# EAGLE design CP_Solenoid3 (EAGLE 7.6.0)
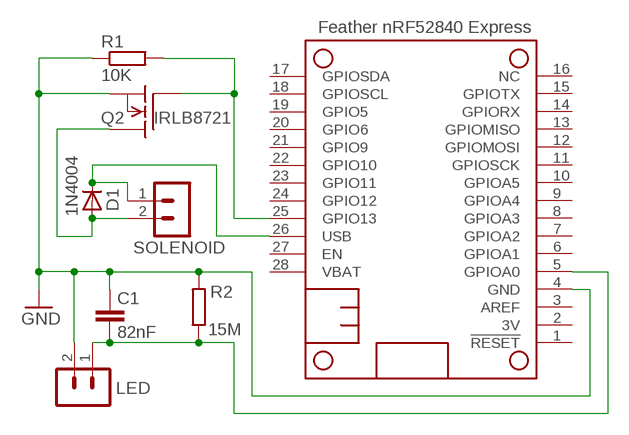
[diagram p0: schematic, sheet 1]

## Parts
C1  82nF  C-EU025-025X050  [C025-025X050]
D1  1N4004  [DO41-10]
LED  B2B-PH-K-S  [B2B-PH-K-S]
MS1  FEATHERWING_NODIM  [FEATHERWING_DIM]
Q2  IRLB8721  IRF510  [TO220]
R1  10K  R-EU_0207/10  [0207/10]
R2  15M  R-EU_0414/15  [0414/15]
SOLENOID  B2B-PH-K-S  [B2B-PH-K-S]

## Nets
GND: C1.1 LED.2 MS1.4(GND) Q2.3(S) R1.1 R2.2
N$2: MS1.25(GPIO13) Q2.1(G) R1.2
N$3: D1.A Q2.2(D) SOLENOID.2
N$7: C1.2 LED.1 MS1.5(GPIOA0) R2.1
USB: D1.C MS1.26(USB) SOLENOID.1
Unconnected: MS1.1(!RESET) MS1.2(3V) MS1.3(AREF) MS1.6(GPIOA1) MS1.7(GPIOA2) MS1.8(GPIOA3) MS1.9(GPIOA4) MS1.10(GPIOA5) MS1.11(GPIOSCK) MS1.12(GPIOMOSI) MS1.13(GPIOMISO) MS1.14(GPIORX) MS1.15(GPIOTX) MS1.16(NC) MS1.17(GPIOSDA) MS1.18(GPIOSCL) MS1.19(GPIO5) MS1.20(GPIO6) MS1.21(GPIO9) MS1.22(GPIO10) MS1.23(GPIO11) MS1.24(GPIO12) MS1.27(EN) MS1.28(VBAT)

## Notes on the sheet
- Feather nRF52840 Express

## Library data of the parts
C1 = rcl:C-EU: CAPACITOR, European symbol
D1 = diode:1N4004: DIODE general purpose rectifier, 1 A
LED SOLENOID = con-JST-ph:B2B-PH: JST PH series header 2.00mm pitch disconnectable crimp style connectors, vertical (side entry type), 2 pins
MS1 = adafruit:FEATHERWING
Q2 = transistor-fet:IRF510: N-Channel Enhancement MOSFET (HEXFET); 100V; 5,6A; 0,54Ohm
R1 R2 = rcl:R-EU_: RESISTOR, European symbol

## Board
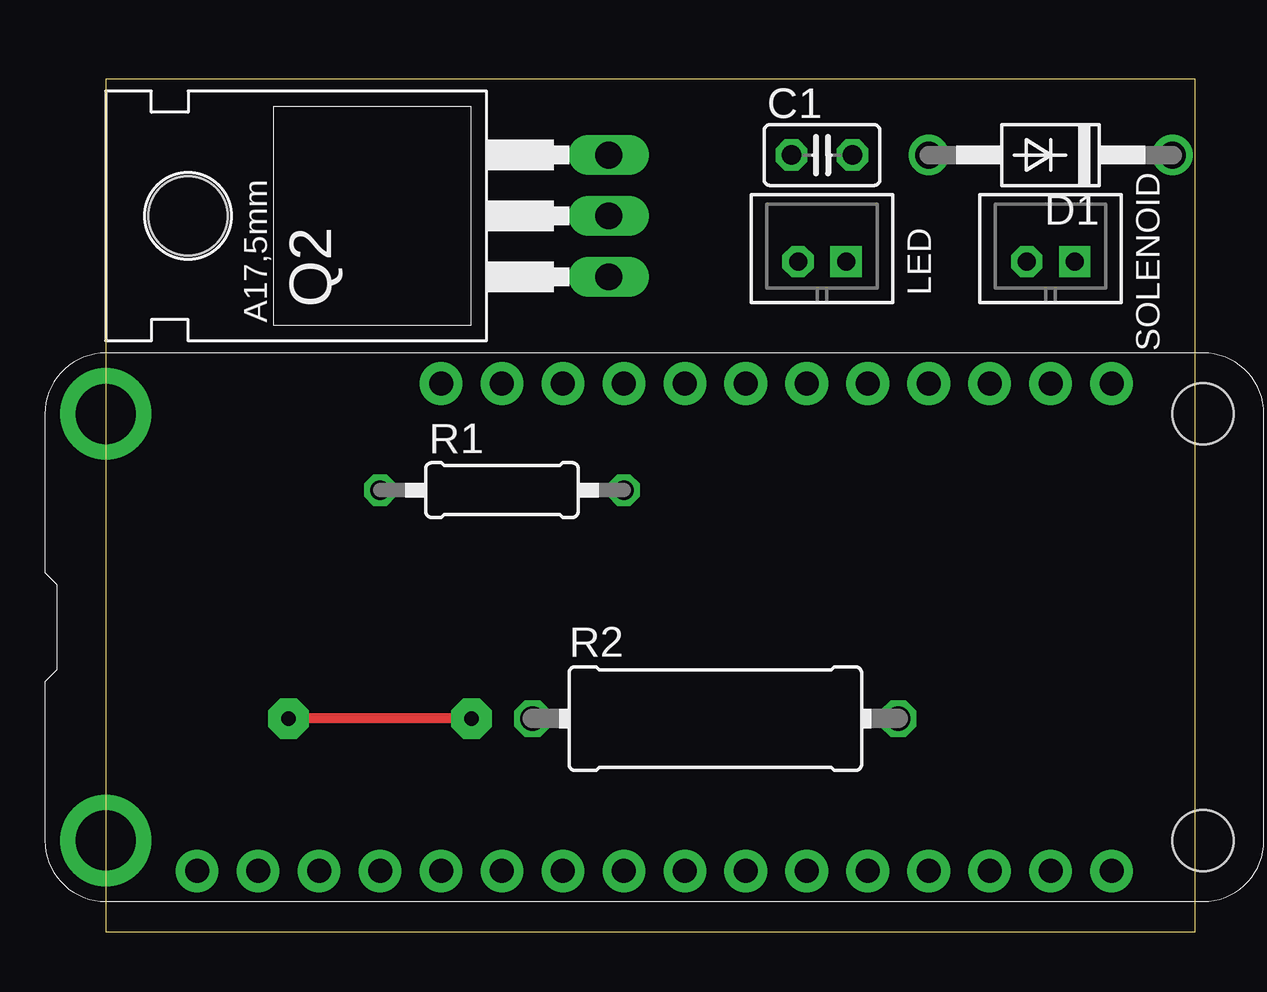
[diagram p1: board, top side]
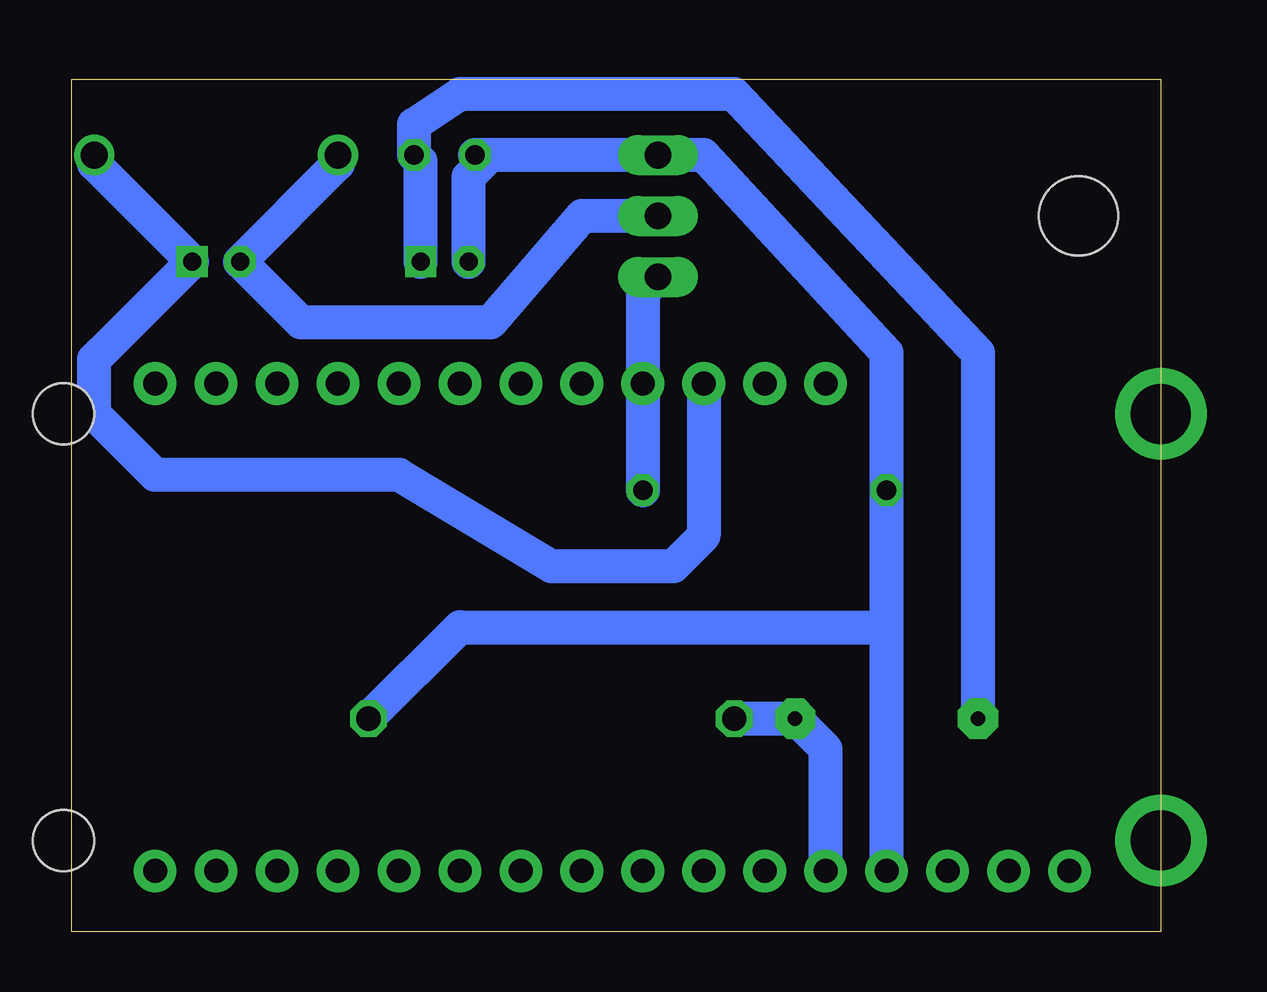
[diagram p2: board, bottom side, seen from below]

Size 45.39 x 35.55 mm. Coordinates in mm from the lower left corner, seen from the top.
Outline: 0,0 45.39,0 45.39,35.55 0,35.55 0,0
Copper layers (1*16): Top 0.035mm / dielectric 1.5mm / Bottom 0.035mm
Design rules "default": minimum track width 10mil, minimum drill 24mil, track to track 8mil, track to pad 8mil, pad to pad 8mil, via to via 8mil, smd to smd 8mil, copper to edge 40mil, drill to drill 8mil, minimum pad ring 10mil, minimum via ring 8mil, stop-mask expansion 4mil, vias tented up to drill 0mil, thermal gap 10mil

### Footprints (pad centres in the part's own frame; a part is rotated, then mirrored left to right if it is on the bottom)
C025-025X050 = drill 0.813 octagon: 1 -1.27,0; 2 1.27,0
DO41-10 = drill 1.118: A 5.08,0; C -5.08,0
B2B-PH-K-S = drill 0.75 pad 1.3 square: 1 1,0 | drill 0.75 pad 1.3 octagon: 2 -1,0
FEATHERWING_DIM = drill 1 pad 1.778: 1 6.35,1.27; 2 8.89,1.27; 3 11.43,1.27; 4 13.97,1.27; 5 16.51,1.27; 6 19.05,1.27; 7 21.59,1.27; 8 24.13,1.27; 9 26.67,1.27; 10 29.21,1.27; 11 31.75,1.27; 12 34.29,1.27; 13 36.83,1.27; 14 39.37,1.27; 15 41.91,1.27; 16 44.45,1.27; 17 44.45,21.59; 18 41.91,21.59; 19 39.37,21.59; 20 36.83,21.59; 21 34.29,21.59; 22 31.75,21.59; 23 29.21,21.59; 24 26.67,21.59; 25 24.13,21.59; 26 21.59,21.59; 27 19.05,21.59; 28 16.51,21.59 | drill 2.5 pad 3.81: P$1 2.54,20.32; P$2 2.54,2.54 | hole 2.54: 48.26,20.32; 48.26,2.54
TO220 = drill 1.118 long: 1 -2.54,-6.35; 2 0,-6.35; 3 2.54,-6.35 | hole 3.302: 0,11.176
0207/10 = drill 0.813 octagon: 1 -5.08,0; 2 5.08,0
0414/15 = drill 1.016 octagon: 1 -7.62,0; 2 7.62,0

### Placement (x,y rotation side)
C1  29.84,32.38 0 top
D1  39.37,32.38 180 top
LED  29.84,27.94 0 top
MS1  -2.54,1.27 0 top
Q2  14.61,29.84 90 top
R1  16.51,18.41 0 top
R2  25.4,8.89 0 top
SOLENOID  39.37,27.94 0 top

### Tracks (layer width: path | path; a pad name or v marks a point on that pad's centre or on a via)
GND
  Bottom 1.422: 11.43,12.7 29.21,12.7 R2.2 | 11.43,12.7 R1.1 11.43,24.13 19.05,32.38 Q2.3 27.94,32.38 | MS1.4 11.43,12.7 | 27.94,32.38 C1.1 | LED.2 28.84,31.48 27.94,32.38
N$2
  Bottom 1.422: Q2.1 21.59,26.67 MS1.25 R1.2
N$3
  Bottom 1.422: Q2.2 24.13,29.84 27.94,25.4 35.83,25.4 SOLENOID.2 34.29,32.02 D1.A
N$7  (via drill 0.6 pad 1.68)
  Top 0.406: v15.24,8.89 v7.62,8.89
  Bottom 1.422: R2.1 v15.24,8.89 13.97,7.62 MS1.5 | v7.62,8.89 7.62,24.13 17.78,34.92 29.21,34.92 31.11,33.66 C1.2 30.84,32.12 LED.1
USB
  Bottom 1.422: MS1.26 19.05,16.51 20.32,15.24 25.4,15.24 31.75,19.05 41.91,19.05 44.45,21.59 44.45,23.88 44.18,24.13 SOLENOID.1 44.45,32.02 D1.C

### Text on the board
tValues: LED | Solenoid | nRF52840 Feather